# Altium schematic sheet misc.schdoc: MISC
size A4; Date: 08.29.2026; CheckedBy: azhaoii; DrawnBy: miaow; Revision: v1.0.0; SheetNumber: 3; SheetTotal: 3; Sample: A0; Url: github.com/miaow-cn/pwrhub-hw; Liscense: CC-BY-SA-4.0; Board: Power Hub; BoardType: MAIN; Desc: miscellaneous
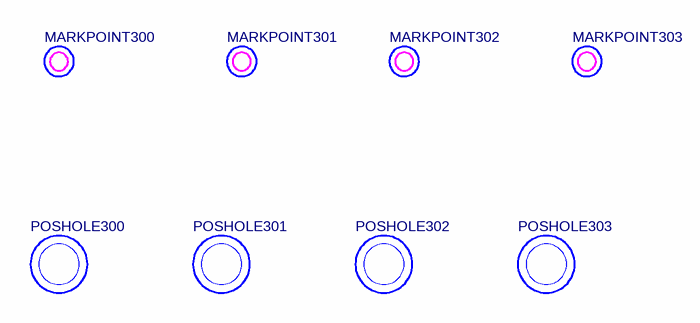
[diagram p0: misc.schdoc]

## Parts
MARKPOINT300  MARKPOINT  [MARKPOINT-1.0]  (value not drawn)
MARKPOINT301  MARKPOINT  [MARKPOINT-1.0]  (value not drawn)
MARKPOINT302  MARKPOINT  [MARKPOINT-1.0]  (value not drawn)
MARKPOINT303  MARKPOINT  [MARKPOINT-1.0]  (value not drawn)
POSHOLE300  POSHOLE  [POSHOLE-3.2]  (value not drawn)
POSHOLE301  POSHOLE  [POSHOLE-3.2]  (value not drawn)
POSHOLE302  POSHOLE  [POSHOLE-3.2]  (value not drawn)
POSHOLE303  POSHOLE  [POSHOLE-3.2]  (value not drawn)

## Notes on the sheet
- DRAWN
- CHECKED
- DRAWNBY
- SHEETS
- SHEETS_NO